# EasyEDA Pro project ProProject_FOC PRO_2025-05-28.epro, board PCB1
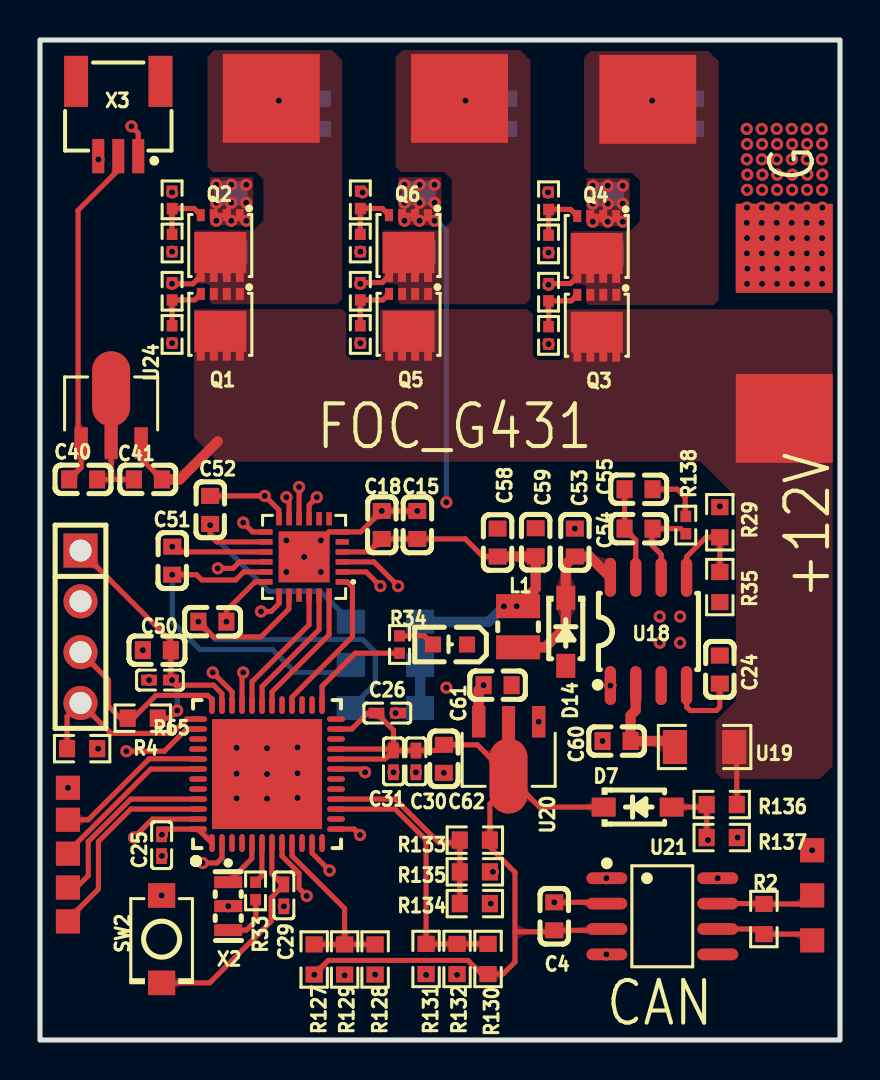
[diagram p2: board, top side]
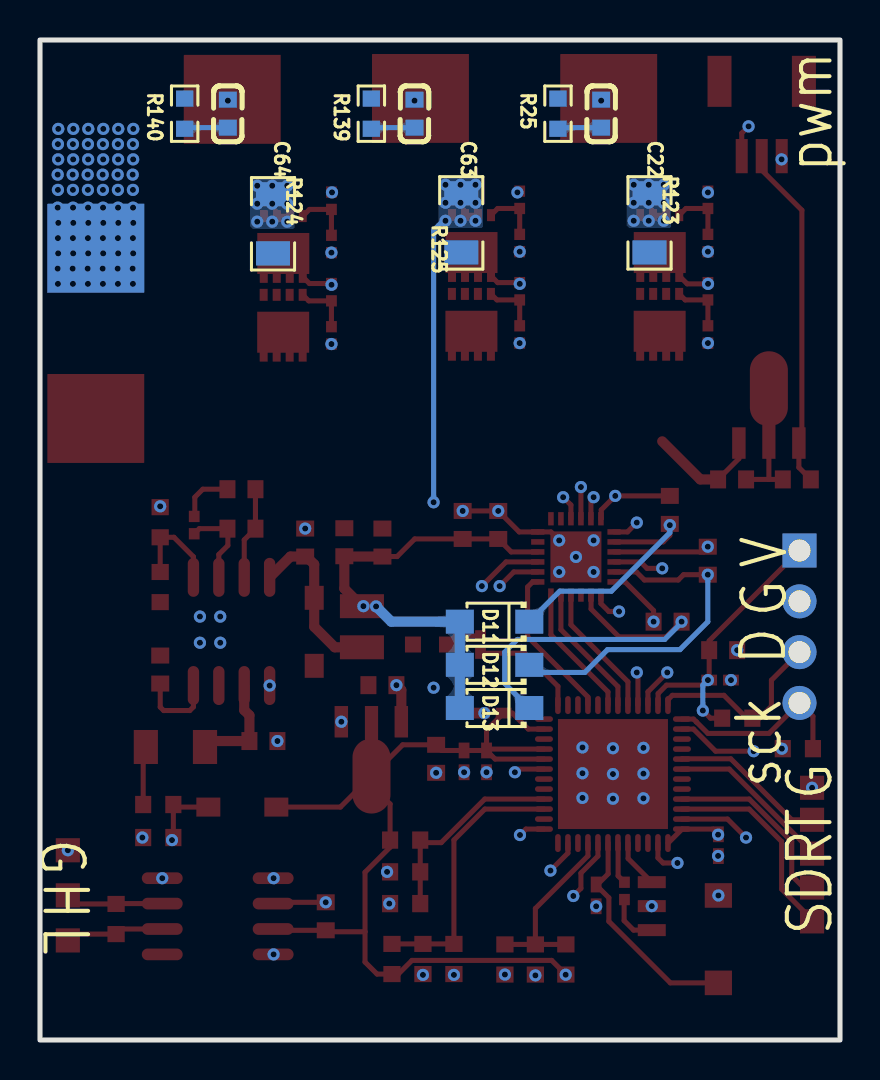
[diagram p3: board, bottom side, seen from below]

Outline 40 x 50 mm; copper layers: Top Layer, Inner1, Inner2, Bottom Layer. Coordinates in mm from the lower left corner of the outline.
Outline path: rectangle 0,50 40,0
Stack: Top Layer 0.035mm 外层铜厚1oz / Dielectric1 0.2104mm 7628 RC49% 8.6mil / Inner1 0.0152mm 内层铜厚 / Dielectric2 1.065mm 1.1mm H/HOZ 含铜 / Inner2 0.0152mm 内层铜厚 / Dielectric3 0.2104mm 7628 RC49% 8.6mil / Bottom Layer 0.035mm 外层铜厚1oz

## Design rules (mm)
template: JLCPCB Capability(Two Layers Board)
spacing copperThickness1oz (default): track to track 0.102, other pairs 0.152 to 0.3
spacing copperThickness2oz: track to track 0.203, other pairs 0.152 to 0.3
track width copperThickness1oz (default): min 0.127, default 0.254, max 2.54
track width copperThickness2oz: min 0.203, default 0.254, max 2.54
differential pair differentialPair (default): width min 0.127, default 0.254, max 2.54; gap min 0.152, default 0.152
via viaSize (default): diameter min 0.5, default 0.61, max 10; hole min 0.3, default 0.305, max 6.3

## Placement (name value [footprint] x y rotation side)
C4  100nF  [C0603]  25.71 6.19 90 top
C15  100nF  [C0603]  18.87 25.75 270 top
C18  10uF  [C0603]  17.09 25.75 270 top
C22  10nF  [C0603]  11.94 46.32 90 bottom
C24  8.2nF  [C0603]  33.99 18.52 270 top
C25  100nF  [c0402_new]  6.08 9.74 90 top
C26  100nF  [c0402_new]  17.36 16.34 180 top
C27  100nF  [c0402_new]  6 18 180 top
C28  4.7uF  [C0603]  5.84 19.49 180 top
C29  100nF  [c0402_new]  12.19 7.23 90 top
C30  1uF  [C0402]  18.8 13.93 90 top
C31  10nF  [C0402]  17.67 13.93 90 top
C40  100nF  [C0603]  2.16 28.03 0 top
C41  330nF  [C0603]  5.4 28.03 0 top
C50  1uF  [C0603]  8.62 20.92 180 top
C51  1uF  [C0603]  6.61 23.97 270 top
C52  1uF  [C0603]  8.51 26.51 270 top
C53  100nF  [C0603]  26.74 24.87 270 top
C54  10pF  [C0603]  29.93 25.57 180 top
C55  1nF  [C0603]  29.93 27.54 180 top
C58  47uF  [C0603]  22.88 24.87 270 top
C59  47uF  [C0603]  24.78 24.89 270 top
C60  22uF  [C0603]  28.83 14.95 180 top
C61  10uF  [C0603]  22.88 17.74 180 top
C62  22uF  [C0603]  20.19 14.06 270 top
C63  10nF  [C0603]  21.27 46.32 90 bottom
C64  10nF  [C0603]  30.61 46.32 90 bottom
D7  B5819W SL  [SOD-123_L2.7-W1.6-LS3.7-RD-1]  29.88 11.65 0 top
D11  FR107  [SOD-123FL_L2.7-W1.8-LS3.8-RD]  17.27 20.92 0 bottom
D12  FR107  [SOD-123FL_L2.7-W1.8-LS3.8-RD]  17.27 18.76 0 bottom
D13  FR107  [SOD-123FL_L2.7-W1.8-LS3.8-RD]  17.27 16.6 0 bottom
D14  B5819W SL  [SOD-123_L2.7-W1.6-LS3.7-RD-1]  26.29 20.41 270 top
H1  PZ254V-11-04P  [HDR-TH_4P-P2.54-V-M]  2.03 20.66 270 top
L1  10uH  [IND-SMD_L2.5-W2.0]  23.9 20.66 90 top
LED4  TLMG1100-GS08  [LED0603-R-RD_GREEN]  20.5 19.77 180 top
NOREF  -  [Pad_e2733]  11.56 47.08 0 top
NOREF#2  -  [Pad_e2515]  38.61 9.49 90 top
NOREF#3  -  [Pad_e11704]  37.21 39.59 0 top
NOREF#4  -  [Pad_e2394]  37.21 31.08 0 top
NOREF#5  -  [Pad_e2508]  38.61 4.98 90 top
NOREF#6  -  [Pad_e1006]  1.4 7.62 90 top
NOREF#7  -  [Pad_e1003]  1.4 11.01 90 top
NOREF#8  -  [Pad_e2772]  20.98 47.08 0 top
NOREF#9  -  [Pad_e2811]  30.39 47.03 0 top
NOREF#10  -  [Pad_e1007]  1.4 9.32 90 top
NOREF#11  -  [Pad_e11511]  37.21 39.59 0 top
NOREF#12  -  [Pad_e2506]  38.61 7.23 90 top
NOREF#13  -  [Pad_e1009]  1.4 5.93 90 top
NOREF#14  -  [Pad_e1189]  1.4 12.61 90 top
Q1  AON7544  [DFN-8_L3.2-W3.1-P0.65-LS3.4-BL]  9.02 35.79 180 top
Q2  AON7544  [DFN-8_L3.2-W3.1-P0.65-LS3.4-BL]  9.01 39.72 180 top
Q3  AON7544  [DFN-8_L3.2-W3.1-P0.65-LS3.4-BL]  27.84 35.74 180 top
Q4  AON7544  [DFN-8_L3.2-W3.1-P0.65-LS3.4-BL]  27.84 39.68 180 top
Q5  AON7544  [DFN-8_L3.2-W3.1-P0.65-LS3.4-BL]  18.43 35.79 180 top
Q6  AON7544  [DFN-8_L3.2-W3.1-P0.65-LS3.4-BL]  18.42 39.72 180 top
R2  120Ω  [R0603]  36.19 6.05 90 top
R4  10kΩ  [r0603]  5.14 16.09 180 top
R25  0603WAF100KT5E  [r0603]  14.1 46.32 270 bottom
R29  10.2kΩ  [R0603]  33.99 25.89 90 top
R33  220Ω  [R0402]  10.78 7.45 90 top
R34  1kΩ  [R0402]  17.98 19.77 90 top
R35  1kΩ  [R0603]  33.99 22.65 90 top
R65  10kΩ  [r0603]  2.11 14.57 180 top
R106  33Ω  [R0402]  6.6 35.28 90 top
R107  33Ω  [R0402]  6.6 42.01 270 top
R108  10kΩ  [R0402]  6.6 37.44 270 top
R109  10kΩ  [R0402]  6.6 39.85 90 top
R111  33Ω  [R0402]  25.43 35.23 90 top
R112  33Ω  [R0402]  25.43 41.96 270 top
R113  10kΩ  [R0402]  25.43 37.39 270 top
R114  10kΩ  [R0402]  25.43 39.8 90 top
R117  33Ω  [R0402]  16.02 35.28 90 top
R118  33Ω  [R0402]  16.02 42.01 270 top
R119  10kΩ  [R0402]  16.02 37.44 270 top
R120  10kΩ  [R0402]  16.02 39.85 90 top
R123  3mΩ  [r1206]  9.53 40.86 90 bottom
R124  3mΩ  [r1206]  28.35 40.81 90 bottom
R125  3mΩ  [r1206]  18.94 40.86 90 bottom
R127  22kΩ  [R0603]  13.71 4.03 270 top
R128  2.2kΩ  [R0603]  16.75 4.03 90 top
R129  1.5kΩ  [R0603]  15.23 4.03 90 top
R130  22kΩ  [R0603]  22.4 4.05 270 top
R131  2.2kΩ  [R0603]  19.3 4.05 90 top
R132  1.5kΩ  [R0603]  20.85 4.05 90 top
R133  22kΩ  [R0603]  21.74 10 0 top
R134  2.2kΩ  [R0603]  21.74 6.82 180 top
R135  1.5kΩ  [R0603]  21.74 8.41 180 top
R136  100kΩ  [R0603]  34.09 11.77 0 top
R137  10kΩ  [R0603]  34.09 10.12 180 top
R138  41.2kΩ  [R0402]  32.29 25.75 90 top
R139  0603WAF100KT5E  [r0603]  23.43 46.32 270 bottom
R140  0603WAF100KT5E  [r0603]  32.77 46.32 270 bottom
SW2  GT-TC029B-H025-L1N  [SW-SMD_L3.9-W3.0-P4.45]  6.08 5.04 270 top
U1  FD6288Q  [qfn-24_l4.0-w4.0-p0.50-bl-ep2.6]  13.2 24.15 90 top
U13  -  [UFQFPN-48_L7.0-W7.0-P0.50-BL-EP]  11.35 13.3 0 top
U18  TPS54331DR  [soic-8_l5.0-w4.0-p1.27-ls6.0-bl]  30.42 20.43 0 top
U19  1206L150/12SLYR  [R1206]  33.23 14.65 0 top
U20  AMS1117-3.3  [SOT-89_L4.5-W2.5-P1.50-LS4.2-BR]  23.43 14.56 90 top
U21  SN65HVD230DR  [SOIC-8_L4.9-W3.9-P1.27-LS6.0-BL]  31.11 6.19 270 top
U24  CJ78L05  [SOT-89-3_L4.5-W2.5-P1.50-LS4.2-BR]  3.56 31.2 270 top
X2  CSTNE8M00GH5C000R0  [OSC-SMD_3P-L3.2-W1.3-P1.20-L]  9.41 6.69 270 top
X3  AFC10-S03QCA-00  [CONN-SMD_AFC10-S03QCA-00]  3.91 46.06 0 top

## Footprints (pads in the part's own frame, mm; a bottom-side part is the same pattern mirrored in y, then rotated)
C0402
  rect 0.79x0.54 smd: 1(-0.545,0) 2(0.545,0)
c0402_new
  rect 0.79x0.54 smd: 1(-0.545,0) 2(0.545,0)
C0603
  rect 0.8x0.9 smd: 1(-0.7,0) 2(0.7,0)
CONN-SMD_AFC10-S03QCA-00
  rect 0.6x1.71 smd: 1(1,-1.87) 2(0,-1.87) 3(-1,-1.87)
  rect 1.2x2.55 smd: 4(-2.11,1.87) 5(2.11,1.87)
DFN-8_L3.2-W3.1-P0.65-LS3.4-BL
  rect 0.4x0.6 smd: 1(-0.975,-1.52) 2(-0.325,-1.52) 3(0.325,-1.52) 4(0.975,-1.52) 5(0.975,1.52) 6(0.325,1.52) 7(-0.325,1.52) 8(-0.975,1.52)
  rect 2.6x2.05 smd: 9(0,0.35)
HDR-TH_4P-P2.54-V-M
  rect 1.7x1.7 hole 1.1: 1(-3.81,0)
  round 1.7 hole 1.1: 2(-1.27,0) 3(1.27,0) 4(3.81,0)
IND-SMD_L2.5-W2.0
  rect 1.2x2.2 smd: 1(1.028,0) 2(-1.028,0)
LED0603-R-RD_GREEN
  rect 0.8x0.8 smd: 1(0.851,0) 2(-0.851,0)
OSC-SMD_3P-L3.2-W1.3-P1.20-L
  rect 0.6x1.4 smd: 1(-1.199,0) 2(0,0) 3(1.199,0)
Pad_e1003
  rect 1.208x1.208 smd: 50(0,0)
Pad_e1006
  rect 1.208x1.208 smd: 50(0,0)
Pad_e1007
  rect 1.208x1.208 smd: 50(0,0)
Pad_e1009
  rect 1.208x1.208 smd: 50(0,0)
Pad_e1189
  rect 1.208x1.208 smd: 50(0,0)
Pad_e2394
  custom 4.846x4.445 smd: 79(0,0)
Pad_e2506
  rect 1.208x1.208 smd: 50(0,0)
Pad_e2508
  rect 1.208x1.208 smd: 50(0,0)
Pad_e2515
  rect 1.208x1.208 smd: 50(0,0)
Pad_e2733
  custom 4.846x4.445 smd: 79(0,0)
Pad_e2772
  custom 4.846x4.445 smd: 79(0,0)
Pad_e2811
  custom 4.847x4.445 smd: 79(0,0)
Pad_e11511
  custom 0x0 smd: 79(0,0)
Pad_e11704
  custom 0x0 smd far side: 79(0,0)
qfn-24_l4.0-w4.0-p0.50-bl-ep2.6
  rect 0.28x0.665 smd: 1(-1.25,-1.907) 2(-0.75,-1.907) 3(-0.25,-1.907) 4(0.25,-1.907) 5(0.75,-1.907) 6(1.25,-1.907) 13(1.25,1.907) 14(0.75,1.907) 15(0.25,1.907) 16(-0.25,1.907) 17(-0.75,1.907) 18(-1.25,1.907)
  rect 0.665x0.28 smd: 7(1.907,-1.25) 8(1.907,-0.75) 9(1.907,-0.25) 10(1.907,0.25) 11(1.907,0.75) 12(1.907,1.25) 19(-1.907,1.25) 20(-1.907,0.75) 21(-1.907,0.25) 22(-1.907,-0.25) 23(-1.907,-0.75) 24(-1.907,-1.25)
  rect 2.55x2.55 smd: 25(0,0)
R0402
  rect 0.566x0.54 smd: 1(-0.433,0) 2(0.433,0)
R0603
  rect 0.806x0.864 smd: 1(-0.753,0) 2(0.753,0)
r0603
  rect 0.806x0.864 smd: 1(-0.753,0) 2(0.753,0)
R1206
  rect 1.208x1.701 smd: 1(-1.479,0) 2(1.479,0)
r1206
  rect 1.208x1.701 smd: 1(-1.479,0) 2(1.479,0)
SOD-123_L2.7-W1.6-LS3.7-RD-1
  rect 1.2x0.95 smd: 1(-1.7,0) 2(1.7,0)
SOD-123FL_L2.7-W1.8-LS3.8-RD
  rect 1.4x1.2 smd: 1(-1.735,0) 2(1.735,0)
SOIC-8_L4.9-W3.9-P1.27-LS6.0-BL
  oval 0.588x2.045 smd: 1(-1.905,-2.772) 2(-0.635,-2.772) 3(0.635,-2.772) 4(1.905,-2.772) 5(1.905,2.772) 6(0.635,2.772) 7(-0.635,2.772) 8(-1.905,2.772)
soic-8_l5.0-w4.0-p1.27-ls6.0-bl
  oval 0.569x1.95 smd: 1(-1.905,-2.705) 2(-0.635,-2.705) 3(0.635,-2.705) 4(1.905,-2.705) 5(1.905,2.705) 6(0.635,2.705) 7(-0.635,2.705) 8(-1.905,2.705)
SOT-89-3_L4.5-W2.5-P1.50-LS4.2-BR
  rect 1.575x0.672 smd: 1(1.356,-1.5) 3(1.356,1.5)
  custom 5.377x1.9 smd: 2(-1.356,0)
SOT-89_L4.5-W2.5-P1.50-LS4.2-BR
  rect 1.575x0.672 smd: 1(1.356,-1.5) 3(1.356,1.5)
  custom 5.377x1.9 smd: 2(-1.356,0.009)
SW-SMD_L3.9-W3.0-P4.45
  rect 1.23x1.36 smd: 1(-2.185,0) 2(2.185,0)
UFQFPN-48_L7.0-W7.0-P0.50-BL-EP
  oval 0.28x0.9 smd: 1(-2.751,-3.45) 2(-2.251,-3.45) 3(-1.75,-3.45) 4(-1.25,-3.45) 5(-0.749,-3.45) 6(-0.249,-3.45) 7(0.249,-3.45) 8(0.75,-3.45) 9(1.25,-3.45) 10(1.75,-3.45) 11(2.251,-3.45) 12(2.751,-3.45) 25(2.751,3.449) 26(2.251,3.449) 27(1.75,3.449) 28(1.25,3.449) 29(0.75,3.449) 30(0.249,3.449) 31(-0.249,3.449) 32(-0.749,3.449) 33(-1.25,3.449) 34(-1.75,3.449) 35(-2.251,3.449) 36(-2.751,3.449)
  oval 0.9x0.28 smd: 13(3.45,-2.751) 14(3.45,-2.251) 15(3.45,-1.75) 16(3.45,-1.25) 17(3.45,-0.75) 18(3.45,-0.249) 19(3.45,0.249) 20(3.45,0.749) 21(3.45,1.25) 22(3.45,1.75) 23(3.45,2.251) 24(3.45,2.751) 37(-3.449,2.751) 38(-3.449,2.251) 39(-3.449,1.75) 40(-3.449,1.25) 41(-3.449,0.749) 42(-3.449,0.249) 43(-3.449,-0.249) 44(-3.449,-0.75) 45(-3.449,-1.25) 46(-3.449,-1.75) 47(-3.449,-2.251) 48(-3.449,-2.751)
  rect 5.5x5.5 smd: 49(0,0)

## Nets
As in the schematic, except:
+6V: C15.2 C18.2 C58.2 C59.2 C61.2 D11.2 D12.2 D13.2 L1.1 R29.2 U1.4 U20.3
+12V: C41.2 NOREF#4.79 Q1.5 Q1.6 Q1.7 Q1.8 Q1.9 Q3.5 Q3.6 Q3.7 Q3.8 Q3.9 Q5.5 Q5.6 Q5.7 Q5.8 Q5.9 R136.2 U19.2 U24.3
GND: C4.2 C15.1 C18.1 C24.1 C25.1 C26.1 C27.2 C28.2 C29.1 C30.1 C31.1 C40.2 C41.1 C54.2 C55.2 C58.1 C59.1 C60.2 C61.1 C62.2 D14.2 H1.2 LED4.2 NOREF#2.50 NOREF#3.79 NOREF#11.79 NOREF#14.50 R25.1 R35.1 R65.1 R109.1 R114.1 R120.1 R123.1 R124.1 R125.1 R128.1 R131.1 R134.1 R137.1 R139.1 R140.1 SW2.1 U1.6 U1.25 U13.11 U13.13 U13.19 U13.49 U18.7 U20.1 U21.2 U21.8 U24.2 X2.2 X3.1 X3.4 X3.5
CANH: NOREF#12.50 R2.2 U21.7
CANL: NOREF#5.50 R2.1 U21.6
I2C1_SCL: NOREF#13.50 U13.46
I2C1_SDA: NOREF#6.50 U13.45
USART2_RX: NOREF#10.50 U13.42
USART2_TX: NOREF#7.50 U13.41
VS1: C22.2 C50.1 NOREF.79 Q1.1 Q1.2 Q1.3 Q2.5 Q2.6 Q2.7 Q2.8 Q2.9 R108.1 U1.18
VS2: C51.1 C63.2 NOREF#8.79 Q5.1 Q5.2 Q5.3 Q6.5 Q6.6 Q6.7 Q6.8 Q6.9 R119.1 U1.15
VS3: C52.1 C64.2 NOREF#9.79 Q3.1 Q3.2 Q3.3 Q4.5 Q4.6 Q4.7 Q4.8 Q4.9 R113.1 U1.12

Pads without a net: U1 5 7 8 21; U13 3 4 10 12 14 17 18 22 24 26 27 29 39 40 43 44; U18 3; U21 5

## Via types
v1: diameter 0.61, hole 0.305, Top Layer to Bottom Layer, 192 vias

## Routing (per net, layer and track width the routed paths; a pad name or vN(x,y) marks a point on that pad's centre or on a via; arc(x,y) is an arc through that point)
+5V: length 17.3
  Top Layer w0.254: X3.2 3.91,43.5 1.91,41.49 1.91,30 U24.1 2.06,28.63 C40.1
+6V: length 44.4
  Top Layer w0.254: C58.2 22.14,24.17 21.26,25.05 C15.2 C18.2 16.44,24.4 U1.4
  Top Layer w0.508: v1(22.18,17.74) 21.93,17.5 U20.3 ; C58.2 24.77,24.17 C59.2 24.78,22.57 L1.1
  Inner1 w0.254: 23.88,21.69 23.88,26.38 24.64,27.14 33.53,27.14 v1(33.99,26.68)
  Inner1 w0.508: 23.88,21.69 23.86,21.68 v1(23.2,21.68) 22.99,21.68 22.18,20.87 v1(22.18,17.74)
  Bottom Layer w0.508: D13.2 D12.2 D11.2 22.43,20.92 v1(23.2,21.68)
  vias: v1(23.83,21.69)
+12V: length 8.8
  Top Layer w0.254: U24.3 5.06,29.07 C41.2 ; R136.2 34.84,14.52 U19.2
  Top Layer w0.508: C41.2 6.98,28.03 8.89,29.93
GND: length 26.5
  Top Layer w0.254: C40.2 3.57,28.03 ; 3.57,28.03 C41.1 ; 3.57,28.03 3.56,28.04 U24.2 ; X3.1 4.91,45.34 v1(4.57,45.68) ; v1(16,10.25) 15.7,10.55 U13.13 ; U18.7 29.79,25.01 C54.2 C55.2 ; 16.26,13.42 16.13,13.55 U13.19 ; v1(18.87,26.45) v1(17.09,26.45) 16.04,25.4 U1.6 14.45,25.4 v1(13.2,24.15) ; U13.11 13.6,9.35 v1(14.48,8.47) ; v1(25.71,6.89) 28.28,6.89 U21.2
  vias: v1(1.4,12.61) v1(2.91,14.57) v1(5.14,19.49) v1(5.45,18) v1(6.1,9.21) v1(6.08,7.23) v1(6.6,39.42) v1(9.41,6.69) v1(9.83,14.61) v1(9.83,13.32) v1(9.83,12.08) v1(11.35,14.59) v1(11.35,13.3) v1(11.35,12.06) v1(12.19,6.69) v1(12.32,24.98) v1(12.32,23.4) v1(12.88,14.63) v1(12.88,13.34) v1(12.88,12.1) v1(14.04,24.98) v1(14.04,23.4) v1(16.02,39.42) v1(16.26,13.39) v1(16.75,3.27) v1(17.67,13.39) v1(17.78,16.34) v1(18.8,13.39) v1(19.3,3.26) v1(20.19,13.36) v1(22.54,6.82) v1(24.93,15.91) v1(25.43,39.37) v1(28.13,14.95) v1(30.99,21.17) v1(30.99,19.86) v1(32,21.17) v1(32,19.86) v1(33.89,8.09) v1(34.88,10.12) v1(35.34,45.56) v1(35.35,44.79) v1(35.34,44.03) v1(35.37,43.27) v1(35.35,42.51) v1(35.35,41.62) v1(35.34,40.86) v1(35.35,40.09) v1(35.34,39.33) v1(35.37,38.57) v1(35.35,37.81) v1(36.09,45.56) v1(36.1,44.79) v1(36.09,44.03) v1(36.12,43.27) v1(36.1,42.51) v1(36.1,41.62) v1(36.09,40.86) v1(36.1,40.09) v1(36.09,39.33) v1(36.12,38.57) v1(36.1,37.81) v1(36.84,45.56) v1(36.85,44.79) v1(36.84,44.03) v1(36.87,43.27) v1(36.85,42.51) v1(36.85,41.62) v1(36.84,40.86) v1(36.85,40.09) v1(36.84,39.33) v1(36.87,38.57) v1(36.85,37.81) v1(37.59,45.56) v1(37.6,44.79) v1(37.59,44.03) v1(37.62,43.27) v1(37.6,42.51) v1(37.6,41.62) v1(37.59,40.86) v1(37.6,40.09) v1(37.59,39.33) v1(37.62,38.57) v1(37.6,37.81) v1(38.34,45.56) v1(38.35,44.79) v1(38.34,44.03) v1(38.37,43.27) v1(38.35,42.51) v1(38.35,41.62) v1(38.34,40.86) v1(38.35,40.09) v1(38.34,39.33) v1(38.37,38.57) v1(38.35,37.81) v1(38.61,9.49) v1(39.09,45.56) v1(39.1,44.79) v1(39.09,44.03) v1(39.12,43.27) v1(39.1,42.51) v1(39.12,41.62) v1(39.09,40.86) v1(39.1,40.09) v1(39.09,39.33) v1(39.12,38.57) v1(39.1,37.81)
VBUS: length 28
  Top Layer w0.254: U13.8 12.1,9.2 12.95,8.34 12.95,7.58 v1(13.33,7.2) ; D7.2 33.21,11.65 R136.1 R137.2
  Inner2 w0.254: v1(33.4,10) 28.45,10 26.09,7.63 13.77,7.63 v1(13.33,7.2)
  Bottom Layer w0.254: v1(33.4,10) 33.27,9.87
VCC: length 87.1
  Top Layer w0.254: 23.75,5.41 25.64,5.41 C4.1 28.28,5.48 U21.3 ; 23.75,5.41 23.75,3.9 23.15,3.3 R130.2 22.08,3.3 21.4,3.98 14.41,3.98 R127.2 ; 23.75,5.41 23.75,8.38 22.5,9.64 R133.2 22.5,11.8 23.37,12.67 23.37,13.14 23.42,13.2 ; C31.2 C30.2 19.91,14.48 C62.1 21.87,14.76 23.42,13.2 ; C31.2 17.6,14.55 U13.21 ; C31.2 17.67,15.49 C26.2 16.38,16.34 15.59,15.55 14.79,15.55 ; C31.2 17.24,14.05 U13.20 ; 23.42,13.2 24.98,11.65 D7.1 ; 9.09,16.75 9.09,17.32 8.67,17.74 6.8,17.74 C27.1 C28.1 6.54,19.96 2.03,24.47 ; 8.59,9.85 7.89,10.55 6.38,10.55 v1(6.1,10.27) ; v1(6.86,16.47) 6.48,16.09 5.89,16.09
  Inner1 w0.254: v1(6.6,18) 6.1,17.49 v1(6.1,10.27) 6.1,10.03 7.11,9.02 7.11,4.41 8.25,3.26 v1(13.72,3.26)
  Bottom Layer w0.254: v1(6.86,16.47) 6.86,17.74 v1(6.6,18) 6.48,17.87
CANH: length 4.9
  Top Layer w0.254: NOREF#12.50 38.18,6.8 R2.2 36.18,6.82 U21.7
CANL: length 5
  Top Layer w0.254: 38.61,4.92 38.23,5.3 R2.1 35.94,5.55 U21.6
CANRX: length 34.6
  Top Layer w0.254: 10.1,16.75 10.1,18.32 v1(10.16,18.38)
  Inner1 w0.254: v1(10.16,18.38) 11.68,19.9 20.57,19.9 21.21,19.27 21.21,6.19 23.11,4.28 v1(28.32,4.28)
CANTX: length 43.5
  Top Layer w0.254: v1(4.7,10.12) 5.62,11.05 U13.47
  Inner1 w0.254: v1(4.7,10.12) 4.7,2.63 5.97,1.36 27.69,1.36 29.84,3.52 29.84,7.45 29.08,8.22 28.45,8.22 v1(28.32,8.09)
HO1: length 19.7
  Top Layer w0.254: U1.19 11.95,21.82 11.56,21.42 v1(11.05,21.42)
  Inner1 w0.254: v1(6.6,34.84) 5.93,34.84 5.33,34.25 5.33,24.85 6.22,23.97 7.07,23.97 9.61,21.42 v1(11.05,21.42)
  Bottom Layer w0.254: v1(11.05,21.42) 11.05,21.3
HO2: length 20.9
  Top Layer w0.254: U1.16 9.97,23.9 9.65,23.58 v1(8.89,23.58)
  Inner1 w0.254: v1(8.89,23.58) 7.62,24.85 7.62,31.46 11.05,34.89 16,34.89 16.13,34.76
  vias: v1(16.02,34.84)
HO3: length 24.1
  Top Layer w0.254: U1.13 10.63,25.4 v1(10.16,25.87)
  Inner1 w0.254: 25.4,34.76 25.4,34 24.51,33.11 11.56,33.11 10.16,31.71 v1(10.16,25.87)
  vias: v1(25.43,34.8)
I2C1_SCL: length 10.3
  Top Layer w0.254: U13.46 4.54,11.55 2.92,9.93 2.92,7.55 1.4,6.02 NOREF#13.50
I2C1_SDA: length 9.3
  Top Layer w0.254: NOREF#6.50 1.82,7.62 2.41,8.22 2.41,9.92 4.54,12.05 U13.45
LO1: length 24.9
  Top Layer w0.254: U1.11 12.45,27.01 v1(12.32,27.14)
  Inner2 w0.254: v1(6.6,42.38) 5.21,42.38 4.44,41.62 4.44,28.92 5.08,28.28 11.18,28.28 v1(12.32,27.14)
LO2: length 19
  Top Layer w0.254: U1.10 v1(12.95,27.65)
  Inner2 w0.254: v1(16.13,42.38) 13.84,42.38 12.95,41.49 v1(12.95,27.65)
LO3: length 26.3
  Top Layer w0.254: v1(13.84,27.14) 13.45,26.75 U1.9
  Inner2 w0.254: v1(13.84,27.14) 19.56,27.14 20.95,28.54 20.95,40.73 22.61,42.38 v1(25.4,42.38)
OPA1+: length 9.2
  Top Layer w0.254: R127.1 R129.2 ; R129.2 R128.2 ; R129.2 15.23,6.58 12.6,9.2 U13.9
OPA2+: length 13.4
  Top Layer w0.254: R130.1 R132.2 R131.2 19.3,10 17.76,11.55 U13.15
OPA3+: length 10.3
  Top Layer w0.254: U13.16 17.76,12.05 19.94,9.87 20.86,9.87 R133.1 R135.2 R134.2
PWM: length 34.8
  Top Layer w0.254: U13.38 7.33,15.55 6.22,14.44 v1(4.32,14.44)
  Inner1 w0.254: v1(4.32,14.44) 3.56,15.2 3.56,25.62 2.16,27.01 2.16,43.27 v1(2.92,44.03)
STATUS: length 5.5
  Top Layer w0.254: U13.25 14.1,17.68 15.76,19.34 R34.1
SWCLK: length 9.4
  Top Layer w0.254: U13.37 7.33,16.05 7.18,15.9 7.18,15.9 6.6,15.33 3.55,15.33 H1.4 1.35,16.18 R65.2
SWDIO: length 9.5
  Top Layer w0.254: 2.03,19.39 3.43,17.99 3.43,16.69 4.02,16.09 R4.2 4.66,16.09 5.8,17.23 8.38,17.23 8.6,17.01 U13.36
TIM1_CH1: length 6.7
  Top Layer w0.254: 11.6,16.75 11.6,17.41 14.45,20.26 U1.24
TIM1_CH1N: length 25.3
  Top Layer w0.254: U1.3 16.7,23.9 v1(17.91,22.7) ; v1(8.13,8.85) 8.85,8.85 9.1,9.11 U13.2
  Inner2 w0.254: v1(8.13,8.85) 8.13,15.08 12.7,19.65 16.64,19.65 17.91,20.92 v1(17.91,22.7)
TIM1_CH2: length 6.7
  Top Layer w0.254: U13.31 11.1,17.67 13.95,20.52 U1.23
TIM1_CH2N: length 15.4
  Top Layer w0.254: U1.2 16.31,23.4 v1(17.02,22.7) ; v1(8.64,18.38) 9.6,17.41 U13.34
  Inner2 w0.254: v1(17.02,22.7) 17.02,21.04 16.51,20.54 10.79,20.54 v1(8.64,18.38)
TIM1_CH3: length 6.7
  Top Layer w0.254: U1.22 13.45,20.76 10.6,17.91 U13.32
TIM1_CH3N: length 7.8
  Top Layer w0.254: U1.1 15.37,22.9 15.62,22.65 15.62,20.17 12.6,17.15 U13.28
USART2_RX: length 8.3
  Top Layer w0.254: U13.42 5.53,13.55 1.4,9.41 NOREF#10.50
USART2_TX: length 7.8
  Top Layer w0.254: NOREF#7.50 2.41,11.01 5.46,14.06 7.89,14.06 U13.41
VB1: length 18.9
  Top Layer w0.254: v1(7.92,20.92) 8.68,20.16 11.05,20.16 12.45,21.55 12.45,22.24 U1.20
  Bottom Layer w0.254: 7.87,20.92 8.76,20.03 16.13,20.03 16.76,19.39 16.76,17.83 D13.1
VB2: length 17.8
  Top Layer w0.254: U1.17 10.18,23.4 9.78,23 8.09,23 7.82,23.27 v1(6.61,23.27)
  Bottom Layer w0.254: 16,18.38 12.76,18.38 11.62,19.52 8,19.52 6.61,20.91 v1(6.61,23.27)
VB3: length 12.7
  Top Layer w0.254: U1.14 8.84,24.9 8.51,25.23 v1(8.51,25.74) C52.2
  Bottom Layer w0.254: v1(8.51,25.74) 8.51,25.36 11.43,22.44 14.01,22.44 D11.1
VF1+: length 57.7
  Top Layer w0.254: 9.4,41.5 9.4,41.24 9.39,41.24 8.76,41.24
  Inner2 w0.254: v1(15.23,3.23) 14.25,2.25 5.5,2.25 3.56,4.19 3.56,42.01 4.94,43.4 8.18,43.4 v1(8.81,42.76)
  vias: v1(8.81,41.86) v1(8.81,40.96) v1(9.56,42.76) v1(9.56,41.86) v1(9.56,40.96) v1(10.31,42.76) v1(10.31,41.86) v1(10.31,40.96)
VF2+: length 39
  Top Layer w0.254: 18.17,41.24 18.81,41.24 18.81,41.24 18.81,41.5
  Inner1 w0.254: v1(20.85,3.26) 20.85,17.08 v1(20.32,17.62)
  Inner2 w0.254: v1(20.32,17.62) v1(20.32,26.89)
  Bottom Layer w0.254: 19.84,40.96 20.32,40.48 v1(20.32,26.89)
  vias: v1(18.23,42.76) v1(18.23,41.86) v1(18.23,40.96) v1(18.98,42.76) v1(18.98,41.86) v1(18.98,40.96) v1(19.73,42.76) v1(19.73,41.86) v1(19.73,40.96)
VF3+: length 36.1
  Top Layer w0.254: 28.22,41.45 28.22,41.2 28.22,41.19 27.58,41.19
  Inner2 w0.254: v1(22.65,8.41) 29.14,14.9 v1(29.14,40.92)
  vias: v1(27.64,42.71) v1(27.64,41.81) v1(27.64,40.92) v1(28.39,42.71) v1(28.39,41.81) v1(28.39,40.92) v1(29.14,42.71) v1(29.14,41.81)
VS1: length 26.8
  Top Layer w0.254: v1(6.6,37.81) 7.64,37.81 Q2.5 ; U1.18 10.75,22.9 9.32,21.47 v1(9.32,20.92)
  Inner1 w0.254: 6.86,37.81 5.08,37.81 3.94,36.67 3.94,25.11 6.37,22.68 7.56,22.68 v1(9.32,20.92)
  vias: v1(11.94,46.97)
VS2: length 26.1
  Top Layer w0.254: R119.1 17.12,37.87 Q6.5 ; U1.15 6.8,24.4 6.61,24.59 v1(6.61,24.67)
  Inner1 w0.254: 16.13,37.81 11.68,37.81 6.61,32.73 v1(6.61,24.67)
  vias: v1(16.01,37.81) v1(21.27,46.97)
VS3: length 29.8
  Top Layer w0.254: R113.1 26.53,37.82 Q4.5 ; 8.51,27.2 v1(11.24,27.2) 11.94,26.51 11.94,26.08 U1.12
  Inner1 w0.254: v1(25.42,37.76) 26.16,37.02 26.16,33.24 24.76,31.84 12.83,31.84 11.24,30.25 v1(11.24,27.2)
  vias: v1(30.61,46.97)
$1N1629: length 2.9
  Top Layer w0.254: Q1.4 7.74,37 R108.2 R106.2
$1N1634: length 2.9
  Top Layer w0.254: R109.2 R107.2 7.7,41.58 Q2.4
$1N2404: length 2.9
  Top Layer w0.254: Q3.4 26.56,36.96 R113.2 R111.2
$1N2407: length 2.9
  Top Layer w0.254: R114.2 R112.2 26.53,41.53 Q4.4
$1N2845: length 2.9
  Top Layer w0.254: Q5.4 17.15,37 R119.2 R117.2
$1N2848: length 2.9
  Top Layer w0.254: R120.2 R118.2 17.12,41.58 Q6.4
$1N7882: length 4.8
  Top Layer w0.254: R35.2 R29.1 33.3,25.14 32.33,24.16 U18.5
$1N7884: length 8.6
  Inner1 w0.508: v1(26.74,25.57) 26.74,23.21 28.45,21.5 28.45,17.79 v1(28.52,17.72)
$1N7885: length 4.1
  Top Layer w0.254: C24.2 33.99,16.65 33.82,16.47 32.51,16.47 32.33,16.66 U18.4
$1N7887: length 8.8
  Top Layer w0.508: U18.8 27.48,24.17 C53.2 26.68,24.17 26.29,23.78 D14.1 26.29,20.66 25.26,19.64 L1.2
$1N7888: length 2.8
  Top Layer w0.254: C55.1 31.86,27.54 32.26,27.14 32.26,26.21 R138.2
$1N7890: length 4.4
  Top Layer w0.254: 32.29,25.31 32.03,25.57 C54.1 30.61,25.55 30.61,24.73 31.06,24.28 U18.6
$1N7895: length 5.2
  Top Layer w0.508: U19.1 31.45,14.95 C60.1 29.53,16.23 29.79,16.49 U18.2
$1N10884: length 2.2
  Bottom Layer w0.254: R25.2 14.05,45.62 C22.1
$1N10959: length 2.2
  Bottom Layer w0.254: R139.2 23.38,45.62 C63.1
$1N11034: length 2.2
  Bottom Layer w0.254: R140.2 32.71,45.62 C64.1
$2N3304: length 2.6
  Top Layer w0.254: R33.1 10.79,7.01 10.79,5.97 10.32,5.49 X2.3
$2N3305: length 2.1
  Top Layer w0.254: 11.09,9.85 11.09,8.21 R33.2
$2N3309: length 11.2
  Top Layer w0.254: SW2.2 8.48,2.86 11.56,5.93 11.56,7.11 12.19,7.75 C29.2 12.13,7.78 11.59,8.31 11.59,9.85
$2N3334: length 2.4
  Top Layer w0.254: 10.59,9.85 10.59,9.08 X2.1
$2N3382: length 1.9
  Top Layer w0.254: LED4.1 19.22,20.21 R34.2

## Copper pours and planes (outline as drawn; the poured copper is in the pictures)
+12V on Top Layer: 7.7,36.54 39.63,36.54 39.63,13.06 7.7,13.06
GND on Top Layer: 0,50 40,50 40,0 0,0
GND on Bottom Layer: 0,49.76 40,49.76 40,0 0,0
GND on Inner1: 0,50 40,50 40,0 0,0
GND on Inner2: 0,50 40,50 40,0 0,0
VF1+ on Top Layer: 8.5,43.14 10.66,43.14 10.66,40.73 8.5,40.73
VF1+ on Bottom Layer: 8.45,43.17 10.67,43.17 10.67,40.6 8.45,40.6
VF2+ on Top Layer: 17.92,43.14 20.08,43.14 20.08,40.73 17.92,40.73
VF2+ on Bottom Layer: 17.86,43.17 20.08,43.17 20.08,40.6 17.86,40.6
VF3+ on Top Layer: 27.33,43.1 29.49,43.1 29.49,40.68 27.33,40.68
VF3+ on Bottom Layer: 27.27,43.12 29.49,43.12 29.49,40.56 27.27,40.56
VS1 on Top Layer: 8.38,49.49 15.11,49.49 15.11,36.79 8.38,36.79
VS1 on Top Layer: 7.75,40.48 10.54,40.48 10.54,36.8 7.75,36.8
VS2 on Top Layer: 17.79,49.49 24.52,49.49 24.52,36.79 17.79,36.79
VS2 on Top Layer: 17.16,40.48 19.95,40.48 19.95,36.8 17.16,36.8
VS3 on Top Layer: 27.2,49.45 33.93,49.45 33.93,36.75 27.2,36.75
VS3 on Top Layer: 26.57,40.44 29.36,40.44 29.36,36.76 26.57,36.76

Small or netless copper shapes (teardrops, artwork), in the pictures only: 253 on Top Layer, 21 on Bottom Layer, 27 on Inner1, 18 on Inner2

## Text on the board
Bottom Silkscreen Layer: H | L | G | T | R | D | S | V | sck | pwm
Top Silkscreen Layer: FOC_G431 | G | +12V | CAN
